# Altium schematic sheet vesc_power.SchDoc
size A4; SheetNumber: 5; SheetTotal: 5
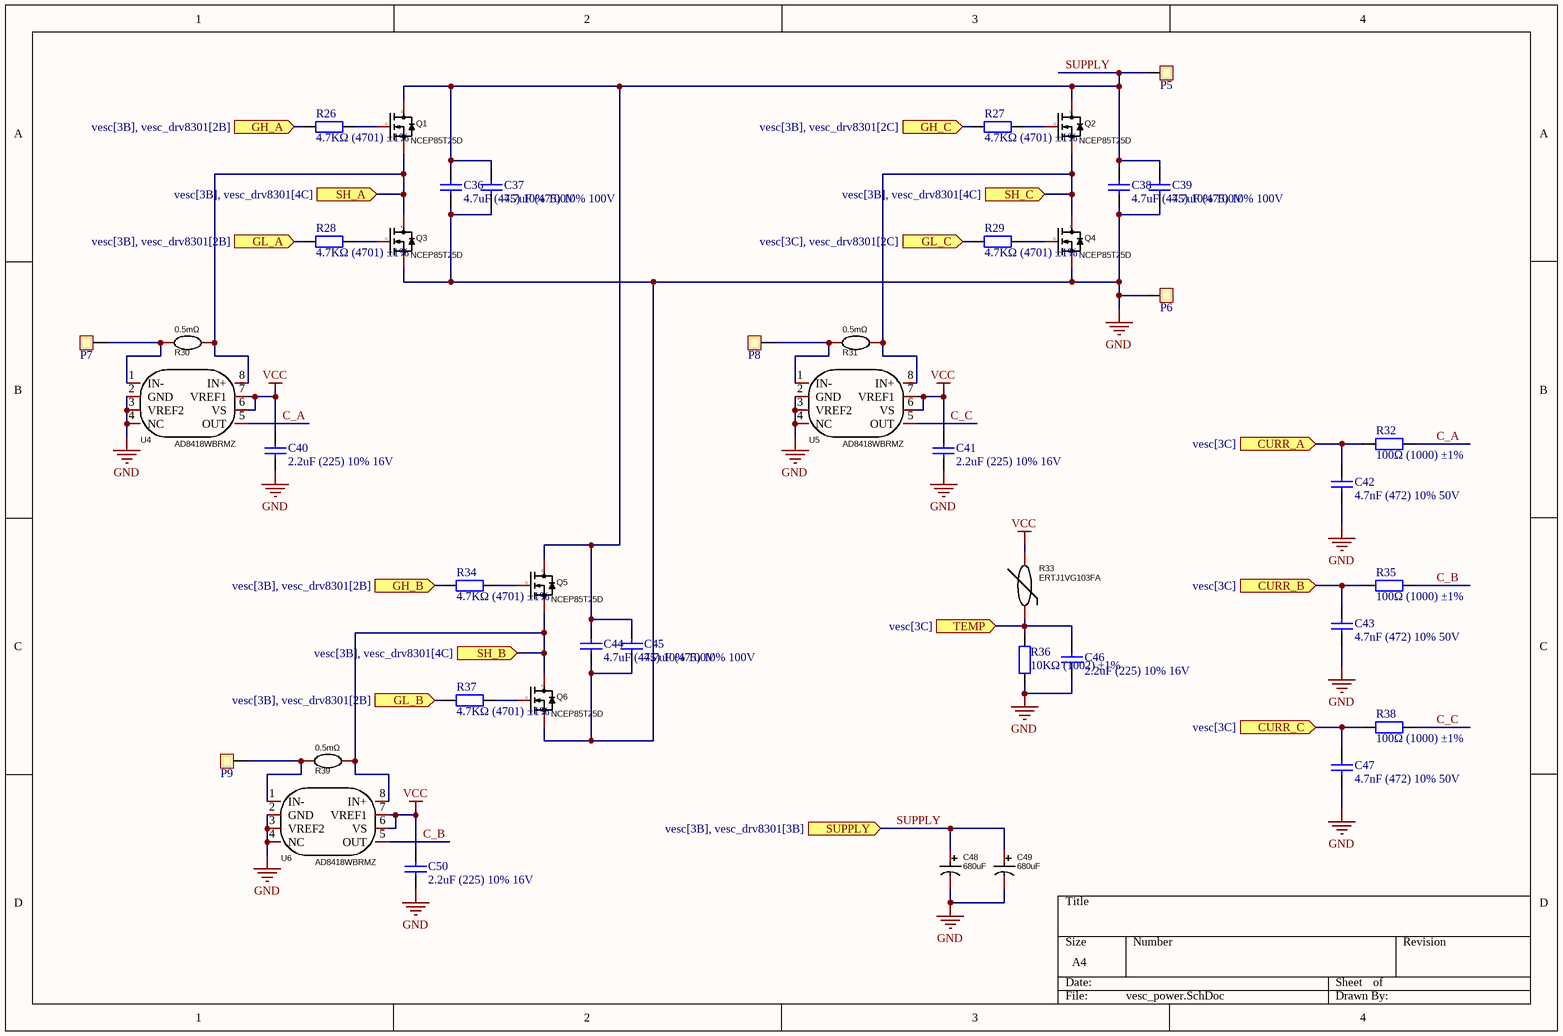
[diagram p0: vesc_power.SchDoc]

## Parts
C36  4.7uF (475) 10% 100V  [1210_C]
C37  4.7uF (475) 10% 100V  [1210_C]
C38  4.7uF (475) 10% 100V  [1210_C]
C39  4.7uF (475) 10% 100V  [1210_C]
C40  2.2uF (225) 10% 16V  [0603_C]
C41  2.2uF (225) 10% 16V  [0603_C]
C42  4.7nF (472) 10% 50V  [0603_C]
C43  4.7nF (472) 10% 50V  [0603_C]
C44  4.7uF (475) 10% 100V  [1210_C]
C45  4.7uF (475) 10% 100V  [1210_C]
C46  2.2uF (225) 10% 16V  [0603_C]
C47  4.7nF (472) 10% 50V  [0603_C]
C48  680uF  [CAP-TH_BD12.5-P5.00-D0.6-FD]
C49  680uF  [CAP-TH_BD12.5-P5.00-D0.6-FD]
C50  2.2uF (225) 10% 16V  [0603_C]
P5  PAD  [PAD]  (value not drawn)
P6  PAD  [PAD]  (value not drawn)
P7  PAD  [PAD]  (value not drawn)
P8  PAD  [PAD]  (value not drawn)
P9  PAD  [PAD]  (value not drawn)
Q1  NCEP85T25D  [TO-263-2_L10.0-W9.1-P5.08-LS15.2-TL]
Q2  NCEP85T25D  [TO-263-2_L10.0-W9.1-P5.08-LS15.2-TL]
Q3  NCEP85T25D  [TO-263-2_L10.0-W9.1-P5.08-LS15.2-TL]
Q4  NCEP85T25D  [TO-263-2_L10.0-W9.1-P5.08-LS15.2-TL]
Q5  NCEP85T25D  [TO-263-2_L10.0-W9.1-P5.08-LS15.2-TL]
Q6  NCEP85T25D  [TO-263-2_L10.0-W9.1-P5.08-LS15.2-TL]
R26  4.7KΩ (4701) ±1%  [0603_R]
R27  4.7KΩ (4701) ±1%  [0603_R]
R28  4.7KΩ (4701) ±1%  [0603_R]
R29  4.7KΩ (4701) ±1%  [0603_R]
R30  0.5mΩ  [R3920]
R31  0.5mΩ  [R3920]
R32  100Ω (1000) ±1%  [0603_R]
R33  ERTJ1VG103FA  [R0603]
R34  4.7KΩ (4701) ±1%  [0603_R]
R35  100Ω (1000) ±1%  [0603_R]
R36  10KΩ (1002) ±1%  [0603_R]
R37  4.7KΩ (4701) ±1%  [0603_R]
R38  100Ω (1000) ±1%  [0603_R]
R39  0.5mΩ  [R3920]
U4  AD8418WBRMZ  [MSOP-8_L3.0-W3.0-P0.65-LS5.0-BL]
U5  AD8418WBRMZ  [MSOP-8_L3.0-W3.0-P0.65-LS5.0-BL]
U6  AD8418WBRMZ  [MSOP-8_L3.0-W3.0-P0.65-LS5.0-BL]

## Ports
CURR_A (in, see vesc[3C]), CURR_B (in, see vesc[3C]), CURR_C (in, see vesc[3C]), GH_A (in, see vesc[3B], vesc_drv8301[2B]), GH_B (in, see vesc[3B], vesc_drv8301[2B]), GH_C (in, see vesc[3B], vesc_drv8301[2C]), GL_A (in, see vesc[3B], vesc_drv8301[2B]), GL_B (in, see vesc[3B], vesc_drv8301[2B]), GL_C (in, see vesc[3C], vesc_drv8301[2C]), SH_A (in, see vesc[3B], vesc_drv8301[4C]), SH_B (in, see vesc[3B], vesc_drv8301[4C]), SH_C (in, see vesc[3B], vesc_drv8301[4C]), SUPPLY (in, see vesc[3B], vesc_drv8301[3B]), TEMP (in, see vesc[3C])

## Nets
GND: C36.1 C37.1 C38.1 C39.1 C40.1 C41.1 C42.1 C43.1 C44.1 C45.1 C46.1 C47.1 C48.2 C49.2 C50.1 P6.1 Q3.3(S) Q4.3(S) Q6.3(S) R36.1 U4.2(GND) U4.3(VREF2) U4.4(NC) U5.2(GND) U5.3(VREF2) U5.4(NC) U6.2(GND) U6.3(VREF2) U6.4(NC)
VCC: C40.2 C41.2 C50.2 R33.2 U4.6(VS) U4.7(VREF1) U5.6(VS) U5.7(VREF1) U6.6(VS) U6.7(VREF1)
C_A: R32.2 U4.5(OUT)
C_B: R35.2 U6.5(OUT)
C_C: R38.2 U5.5(OUT)
CURR_A: C42.2 R32.1 ; port CURR_A
CURR_B: C43.2 R35.1 ; port CURR_B
CURR_C: C47.2 R38.1 ; port CURR_C
GH_A: R26.1 ; port GH_A
GH_B: R34.1 ; port GH_B
GH_C: R27.1 ; port GH_C
GL_A: R28.1 ; port GL_A
GL_B: R37.1 ; port GL_B
GL_C: R29.1 ; port GL_C
SH_A: Q1.3(S) Q3.4(D) R30.2 U4.8(IN+) ; port SH_A
SH_B: Q5.3(S) Q6.4(D) R39.2 U6.8(IN+) ; port SH_B
SH_C: Q2.3(S) Q4.4(D) R31.2 U5.8(IN+) ; port SH_C
SUPPLY: C36.2 C37.2 C38.2 C39.2 C44.2 C45.2 C48.1 C49.1 P5.1 Q1.4(D) Q2.4(D) Q5.4(D) ; port SUPPLY
TEMP: C46.2 R33.1 R36.2 ; port TEMP
NetP7_1: P7.1 R30.1 U4.1(IN-)
NetP8_1: P8.1 R31.1 U5.1(IN-)
NetP9_1: P9.1 R39.1 U6.1(IN-)
NetQ1_1: Q1.1(G) R26.2
NetQ2_1: Q2.1(G) R27.2
NetQ3_1: Q3.1(G) R28.2
NetQ4_1: Q4.1(G) R29.2
NetQ5_1: Q5.1(G) R34.2
NetQ6_1: Q6.1(G) R37.2

## Library data of the parts
C36-C39 C44 C45 = 1206 4.7uF (475) 10% 50V: 贴片电容; ComponentLink1Description: 供应商链接; ComponentLink1URL: http://www.szlcsc.com/product/details_30577.html; Package: 1206; Supplier: LC; SuppliersPartNumber: C29823
C40 C41 C46 C50 = 0603 2.2uF (225) 10% 16V: 贴片电容; ComponentLink1Description: 供应商链接; ComponentLink1URL: http://www.szlcsc.com/product/details_24366.html; Package: 0603; Supplier: LC; SuppliersPartNumber: C23630
C42 C43 C47 = 0603 4.7nF (472) 10% 50V: 贴片电容; ComponentLink1Description: 供应商链接; ComponentLink1URL: http://www.szlcsc.com/product/details_55004.html; Package: 0603; Supplier: LC; SuppliersPartNumber: C53987
C48 C49 = ERR1JM681W25OT: Manufacturer: AISHI(艾华集团); Add into BOM: yes; Tolerance: ±20%; Rated Voltage: 63V; φD: 12.5mm; L: 25mm; Lifetime @ Temp: 2000hrs@105℃; Name: 680uF; Symbol: ERR1JM681W25OT; Device: ERR1JM681W25OT; LCSC Part Name: 680uF ±20% 63V; Supplier Part: C106632; Manufacturer Part: ERR1JM681W25OT; Supplier Footprint: 插件,D12.5xL25mm; JLCPCB Part Class: Extended Part; Datasheet: https://atta.szlcsc.com/upload/public/pdf/source/20190702/C401591_1676EF45BC9A88BD1D6B22BBAE3913C7.pdf; Supplier: LCSC; Convert to PCB: yes; Value: 680uF; Lead Spacing: 5mm
P5-P9 = PAD: Manufacturer: AMASS(艾迈斯); Name: XT30U-M; Symbol: DC电源; Pin Type: IN; Add into BOM: yes; Device: XT30U-M; Convert to PCB: yes; Supplier Part: C99101; Supplier: LCSC; Manufacturer Part: XT30U-M; JLCPCB Part Class: 扩展库
Q1-Q6 = NCEP85T25D: Manufacturer: NCE(无锡新洁能); Add into BOM: yes; Type: N沟道; Drain Source Voltage (Vdss): 85V; Continuous Drain Current (Id): 250A; Power Dissipation (Pd): 300W; Drain Source On Resistance (RDS(on)@Vgs,Id): 2.6mΩ@10V,100A; Gate Threshold Voltage (Vgs(th)@Id): 4.5V@250uA; Name: NCEP85T25D; Symbol: NCEP85T25D; Device: NCEP85T25D; LCSC Part Name: N沟道 耐压:85V 电流:250A; Supplier Part: C181921; Manufacturer Part: NCEP85T25D; Supplier Footprint: TO-263-2; JLCPCB Part Class: Extended Part; Datasheet: https://atta.szlcsc.com/upload/public/pdf/source/20180131/C181921_15173932479761329348.pdf; Supplier: LCSC; Convert to PCB: yes
R26-R29 R34 R37 = 0603 4.7KΩ (4701) 1%: 贴片电阻; ComponentLink1Description: 供应商链接; ComponentLink1URL: http://www.szlcsc.com/product/details_23889.html; Package: 0603; Supplier: LC; SuppliersPartNumber: C23162
R30 R31 R39 = ASR-M-5-0.5F: Manufacturer: yezhan(业展); Add into BOM: yes; Tolerance: ±1%; Power(Watts): 9W; Temperature Coefficient: ±70ppm/℃; Mounting Sytle: 贴片; Name: 0.5mΩ; Symbol: ASR-M-5-0.5F; Device: ASR-M-5-0.5F; LCSC Part Name: 0.5mΩ ±1% 9W; Supplier Part: C469433; Manufacturer Part: ASR-M-5-0.5F; Supplier Footprint: 3920; JLCPCB Part Class: Extended Part; Datasheet: https://atta.szlcsc.com/upload/public/pdf/source/20231030/E912096EFF708041568A0F74B4C79E56.pdf; Supplier: LCSC; Convert to PCB: yes; Type: 分流器; Value: 0.5mΩ; Rated Output Voltage: -; Rated Current: -
R32 R35 R38 = 0603 100Ω (1000) 1%: 贴片电阻; ComponentLink1Description: 供应商链接; ComponentLink1URL: http://www.szlcsc.com/product/details_23502.html; Package: 0603; Supplier: LC; SuppliersPartNumber: C22775
R33 = ERTJ1VG103FA: Manufacturer: PANASONIC(松下); Symbol: ERT-J1VG103FA; Add into BOM: yes; Resistance @ 25℃: 10kΩ; B Constant (25℃/50℃): 3380K; Resistance Tolerance: ±1%; B Constant (25℃/85℃): 3435K; Power: 100mW; Name: ERTJ1VG103FA; Device: ERTJ1VG103FA; LCSC Part Name: 10kΩ 电阻精度:±1% 3380K; Supplier Part: C153011; Manufacturer Part: ERTJ1VG103FA; Supplier Footprint: 0603; JLCPCB Part Class: Extended Part; Datasheet: https://atta.szlcsc.com/upload/public/pdf/source/20180420/C178739_3B90639CA07E4EB840BCF39529957312.pdf; Supplier: LCSC; Convert to PCB: yes; B Constant (25℃/75℃): -; B Constant (25℃/100℃): -; B Constant Tolerance: ±1%; Steady State Current (Max): -; Operating Temperature: -40℃~+125℃
R36 = 0603 10KΩ (1002) 1%: 贴片电阻; ComponentLink1Description: 供应商链接; ComponentLink1URL: http://www.szlcsc.com/product/details_26547.html; Package: 0603; Supplier: LC; SuppliersPartNumber: C25804
U4-U6 = AD8418WBRMZ: Manufacturer: ADI(亚德诺); Add into BOM: yes; Number of Channels: 单路; Supply Current: 2.6mA; Name: AD8418WBRMZ; Symbol: AD8418WBRMZ; Device: AD8418WBRMZ; LCSC Part Name: AD8418WBRMZ; Supplier Part: C207727; Manufacturer Part: AD8418WBRMZ; Supplier Footprint: MSOP-8; JLCPCB Part Class: Extended Part; Datasheet: https://atta.szlcsc.com/upload/public/pdf/source/20200312/C495342_AB22F5CA716828B66C7BAA0F926F15C0.pdf; Supplier: LCSC; Convert to PCB: yes; Operating Temperature: -40℃~+125℃